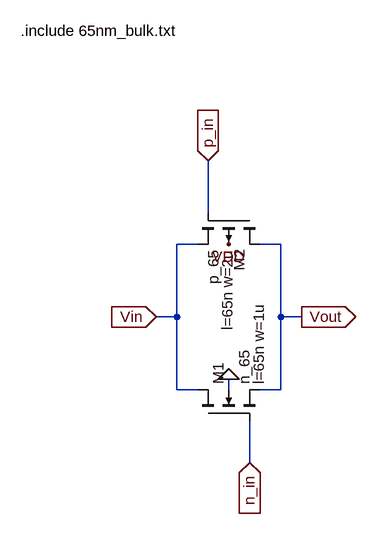
[diagram p0: schematic transmission_gate.asc]
transmission_gate.asc, the LTspice schematic file:
Version 4
SHEET 1 880 924
WIRE 64 368 64 288
WIRE 48 416 16 416
WIRE 176 416 144 416
WIRE 16 528 16 416
WIRE 16 528 -16 528
WIRE 176 528 176 416
WIRE 208 528 176 528
WIRE 16 640 16 528
WIRE 48 640 16 640
WIRE 96 640 96 624
WIRE 176 640 176 528
WIRE 176 640 144 640
WIRE 128 752 128 688
FLAG 96 624 0
FLAG 96 416 VDD
FLAG 128 752 n_in
IOPIN 128 752 In
FLAG 64 288 p_in
IOPIN 64 288 In
FLAG -16 528 Vin
IOPIN -16 528 In
FLAG 208 528 Vout
IOPIN 208 528 Out
SYMBOL nmos4 48 688 R270
WINDOW 123 56 94 Left 2
SYMATTR Value2 l=65n w=1u
SYMATTR InstName M1
SYMATTR Value n_65
SYMBOL pmos4 144 368 R90
WINDOW 123 56 50 Left 2
SYMATTR Value2 l=65n w=2u
SYMATTR InstName M2
SYMATTR Value p_65
TEXT -224 88 Left 2 !.include 65nm_bulk.txt

The netlist it stands for:
* transmission_gate.asc
M1 Vin n_in Vout 0 n_65 l=65n w=1u
M2 Vout p_in Vin VDD p_65 l=65n w=2u
.model NMOS NMOS
.model PMOS PMOS
.lib standard.mos
.include 65nm_bulk.txt
.backanno
.end